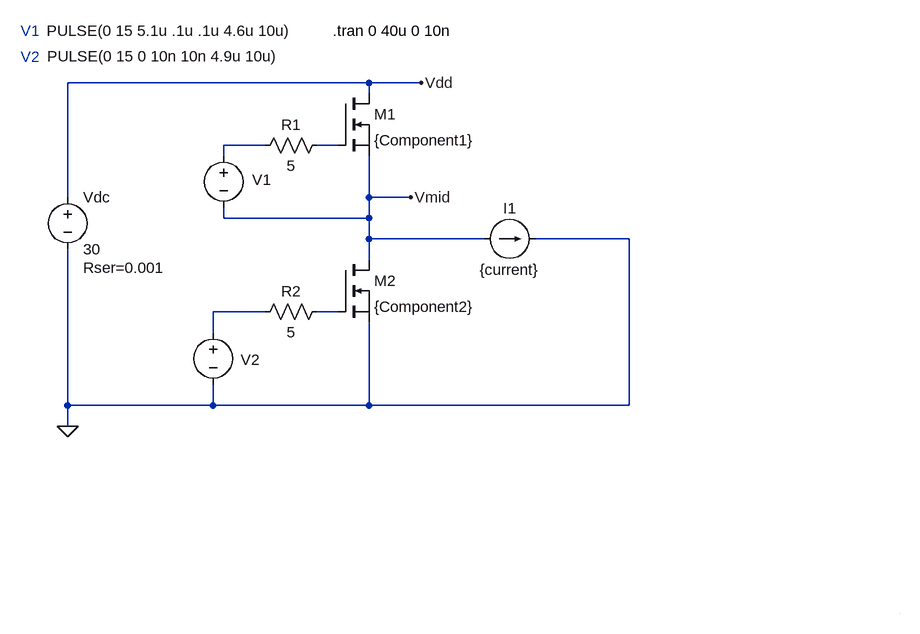
[diagram p0: schematic Abaixador_rv00.asc]
Abaixador_rv00.asc, the LTspice schematic file:
Version 4
SHEET 1 880 824
WIRE -816 -816 -1280 -816
WIRE -736 -816 -816 -816
WIRE -816 -800 -816 -816
WIRE -976 -720 -1040 -720
WIRE -864 -720 -896 -720
WIRE -1040 -704 -1040 -720
WIRE -1280 -640 -1280 -816
WIRE -816 -640 -816 -704
WIRE -752 -640 -816 -640
WIRE -1040 -608 -1040 -624
WIRE -816 -608 -816 -640
WIRE -816 -608 -1040 -608
WIRE -816 -576 -816 -608
WIRE -640 -576 -816 -576
WIRE -416 -576 -560 -576
WIRE -816 -544 -816 -576
WIRE -976 -464 -1056 -464
WIRE -864 -464 -896 -464
WIRE -1056 -432 -1056 -464
WIRE -1280 -320 -1280 -560
WIRE -1056 -320 -1056 -352
WIRE -1056 -320 -1280 -320
WIRE -816 -320 -816 -448
WIRE -816 -320 -1056 -320
WIRE -416 -320 -416 -576
WIRE -416 -320 -816 -320
WIRE -1280 -288 -1280 -320
WIRE 0 0 0 0
FLAG -1280 -288 0
FLAG -736 -816 Vdd
FLAG -752 -640 Vmid
SYMBOL voltage -1280 -656 R0
WINDOW 123 0 0 Left 0
WINDOW 39 24 124 Left 2
SYMATTR SpiceLine Rser=0.001
SYMATTR InstName Vdc
SYMATTR Value 30
SYMBOL current -640 -576 R270
WINDOW 0 32 40 VTop 2
WINDOW 3 -32 40 VBottom 2
WINDOW 123 0 0 Left 0
WINDOW 39 0 0 Left 0
SYMATTR InstName I1
SYMATTR Value {current}
SYMBOL nmos -864 -544 R0
SYMATTR InstName M2
SYMATTR Value {Component2}
SYMBOL nmos -864 -800 R0
SYMATTR InstName M1
SYMATTR Value {Component1}
SYMBOL res -880 -480 R90
WINDOW 0 0 56 VBottom 2
WINDOW 3 32 56 VTop 2
SYMATTR InstName R2
SYMATTR Value 5
SYMBOL voltage -1056 -448 R0
WINDOW 123 0 0 Left 0
WINDOW 39 0 0 Left 0
WINDOW 0 42 58 Left 2
WINDOW 3 -255 -409 Left 2
SYMATTR InstName V2
SYMATTR Value PULSE(0 15 0 10n 10n 4.9u 10u)
SYMBOL voltage -1040 -720 R0
WINDOW 3 -272 -176 Left 2
WINDOW 123 0 0 Left 0
WINDOW 39 0 0 Left 0
WINDOW 0 44 53 Left 2
SYMATTR Value PULSE(0 15 5.1u .1u .1u 4.6u 10u)
SYMATTR InstName V1
SYMBOL res -880 -736 R90
WINDOW 0 0 56 VBottom 2
WINDOW 3 32 56 VTop 2
SYMATTR InstName R1
SYMATTR Value 5
TEXT -872 -896 Left 2 !.tran 0 40u 0 10n
TEXT -1352 -896 Left 2 ;V1
TEXT -1352 -856 Left 2 ;V2

The netlist it stands for:
* Abaixador_rv00.asc
Vdc Vdd 0 30 Rser=0.001
I1 Vmid 0 {current}
M2 Vmid N004 0 0 {Component2}
M1 Vdd N002 Vmid Vmid {Component1}
R2 N004 N003 5
V2 N003 0 PULSE(0 15 0 10n 10n 4.9u 10u)
V1 N001 Vmid PULSE(0 15 5.1u .1u .1u 4.6u 10u)
R1 N002 N001 5
.model NMOS NMOS
.model PMOS PMOS
.lib standard.mos
.tran 0 40u 0 10n
* V1
* V2
.backanno
.end